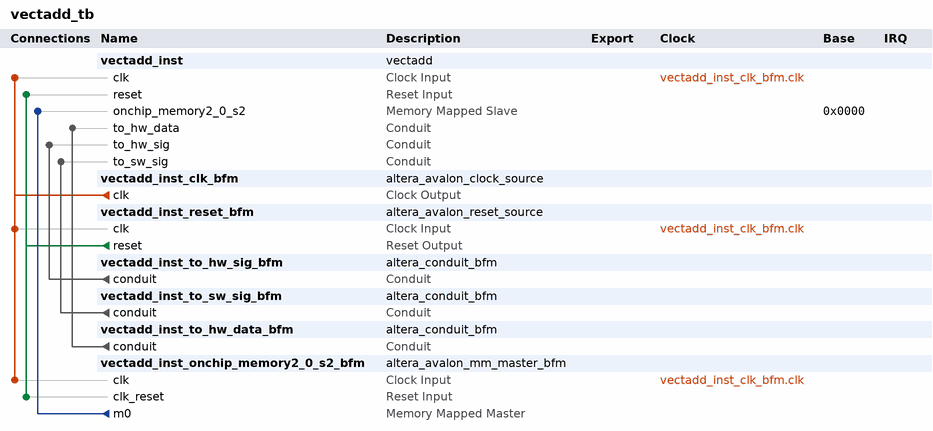
[diagram p0: system contents]
# Platform Designer (Qsys) system vectadd_tb, Cyclone II EP2C35F672C6
# Parameters at their usual value, and those the tool derives, are not listed.
package require -exact qsys 13.0
create_system vectadd_tb
set_project_property DEVICE_FAMILY {Cyclone II}
set_project_property DEVICE EP2C35F672C6

add_instance vectadd_inst vectadd 1.0

add_instance vectadd_inst_clk_bfm altera_avalon_clock_source 13.0

add_instance vectadd_inst_reset_bfm altera_avalon_reset_source 13.0
set_instance_parameter_value vectadd_inst_reset_bfm ASSERT_HIGH_RESET 0
set_instance_parameter_value vectadd_inst_reset_bfm INITIAL_RESET_CYCLES 50

add_instance vectadd_inst_to_hw_sig_bfm altera_conduit_bfm 13.0
set_instance_parameter_value vectadd_inst_to_hw_sig_bfm CLOCKED_SIGNAL false
set_instance_parameter_value vectadd_inst_to_hw_sig_bfm ENABLE_RESET false
set_instance_parameter_value vectadd_inst_to_hw_sig_bfm SIGNAL_WIDTHS 2
set_instance_parameter_value vectadd_inst_to_hw_sig_bfm SIGNAL_DIRECTIONS input

add_instance vectadd_inst_to_sw_sig_bfm altera_conduit_bfm 13.0
set_instance_parameter_value vectadd_inst_to_sw_sig_bfm CLOCKED_SIGNAL false
set_instance_parameter_value vectadd_inst_to_sw_sig_bfm ENABLE_RESET false
set_instance_parameter_value vectadd_inst_to_sw_sig_bfm SIGNAL_WIDTHS 2
set_instance_parameter_value vectadd_inst_to_sw_sig_bfm SIGNAL_DIRECTIONS output

add_instance vectadd_inst_to_hw_data_bfm altera_conduit_bfm 13.0
set_instance_parameter_value vectadd_inst_to_hw_data_bfm CLOCKED_SIGNAL false
set_instance_parameter_value vectadd_inst_to_hw_data_bfm ENABLE_RESET false
set_instance_parameter_value vectadd_inst_to_hw_data_bfm SIGNAL_WIDTHS 32
set_instance_parameter_value vectadd_inst_to_hw_data_bfm SIGNAL_DIRECTIONS input

add_instance vectadd_inst_onchip_memory2_0_s2_bfm altera_avalon_mm_master_bfm 13.0
set_instance_parameter_value vectadd_inst_onchip_memory2_0_s2_bfm AV_ADDRESS_W 14
set_instance_parameter_value vectadd_inst_onchip_memory2_0_s2_bfm AV_NUMSYMBOLS 4
set_instance_parameter_value vectadd_inst_onchip_memory2_0_s2_bfm AV_BURSTCOUNT_W 1
set_instance_parameter_value vectadd_inst_onchip_memory2_0_s2_bfm AV_READRESPONSE_W 1
set_instance_parameter_value vectadd_inst_onchip_memory2_0_s2_bfm AV_WRITERESPONSE_W 1
set_instance_parameter_value vectadd_inst_onchip_memory2_0_s2_bfm USE_READ 1
set_instance_parameter_value vectadd_inst_onchip_memory2_0_s2_bfm USE_BYTE_ENABLE 1
set_instance_parameter_value vectadd_inst_onchip_memory2_0_s2_bfm USE_BURSTCOUNT 0
set_instance_parameter_value vectadd_inst_onchip_memory2_0_s2_bfm USE_READ_DATA 1
set_instance_parameter_value vectadd_inst_onchip_memory2_0_s2_bfm USE_READ_DATA_VALID 0
set_instance_parameter_value vectadd_inst_onchip_memory2_0_s2_bfm USE_WAIT_REQUEST 0
set_instance_parameter_value vectadd_inst_onchip_memory2_0_s2_bfm USE_CLKEN 1
set_instance_parameter_value vectadd_inst_onchip_memory2_0_s2_bfm AV_CONSTANT_BURST_BEHAVIOR 1
set_instance_parameter_value vectadd_inst_onchip_memory2_0_s2_bfm AV_BURST_LINEWRAP 0
set_instance_parameter_value vectadd_inst_onchip_memory2_0_s2_bfm AV_BURST_BNDR_ONLY 0
set_instance_parameter_value vectadd_inst_onchip_memory2_0_s2_bfm AV_FIX_READ_LATENCY 1
set_instance_parameter_value vectadd_inst_onchip_memory2_0_s2_bfm AV_READ_WAIT_TIME 0
set_instance_parameter_value vectadd_inst_onchip_memory2_0_s2_bfm ADDRESS_UNITS WORDS
set_instance_parameter_value vectadd_inst_onchip_memory2_0_s2_bfm VHDL_ID 0

# connections
add_connection vectadd_inst_clk_bfm.clk vectadd_inst.clk clock
add_connection vectadd_inst_clk_bfm.clk vectadd_inst_onchip_memory2_0_s2_bfm.clk clock
add_connection vectadd_inst_clk_bfm.clk vectadd_inst_reset_bfm.clk clock
add_connection vectadd_inst_reset_bfm.reset vectadd_inst.reset reset
add_connection vectadd_inst_reset_bfm.reset vectadd_inst_onchip_memory2_0_s2_bfm.clk_reset reset
add_connection vectadd_inst_onchip_memory2_0_s2_bfm.m0 vectadd_inst.onchip_memory2_0_s2 avalon
set_connection_parameter_value vectadd_inst_onchip_memory2_0_s2_bfm.m0/vectadd_inst.onchip_memory2_0_s2 baseAddress 0x0000
add_connection vectadd_inst_to_hw_data_bfm.conduit vectadd_inst.to_hw_data conduit
add_connection vectadd_inst_to_hw_sig_bfm.conduit vectadd_inst.to_hw_sig conduit
add_connection vectadd_inst_to_sw_sig_bfm.conduit vectadd_inst.to_sw_sig conduit

set_interconnect_requirement {$system} qsys_mm.clockCrossingAdapter HANDSHAKE
set_interconnect_requirement {$system} qsys_mm.maxAdditionalLatency 1

save_system vectadd_tb.qsys
